# Altium schematic sheet TopDrivers.SchDoc
size A4; SheetNumber: 1; SheetTotal: 2
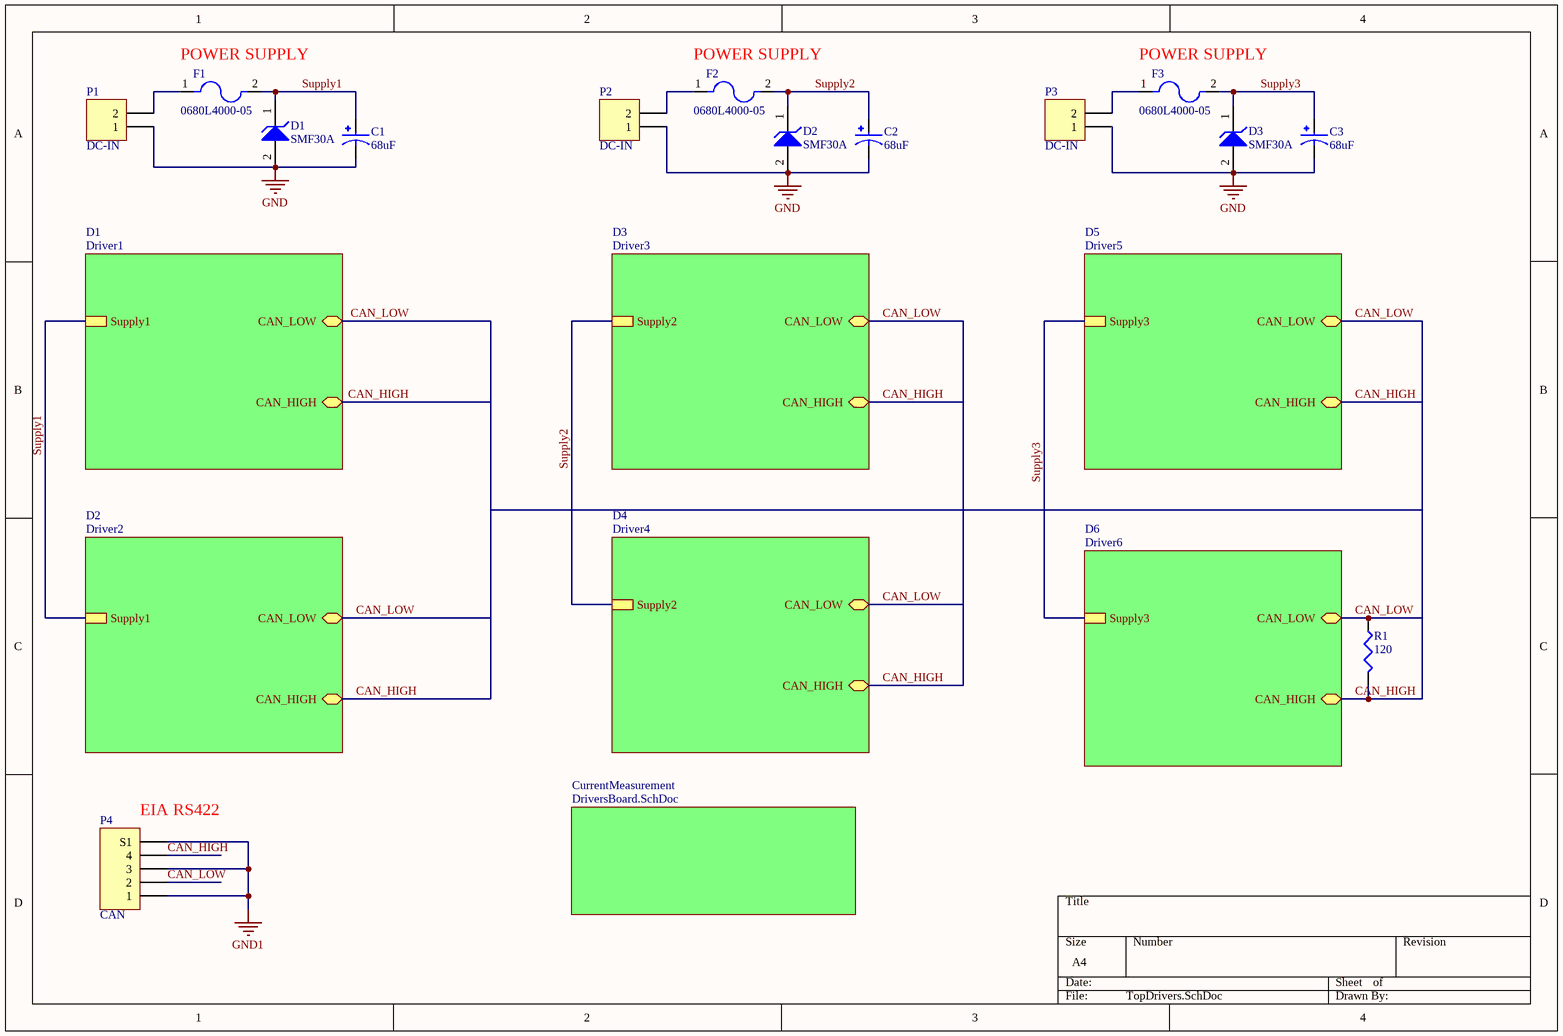
[diagram p0: TopDrivers.SchDoc]

## Parts
C1  68uF  [CAP_50SVT68M]
C2  68uF  [CAP_50SVT68M]
C3  68uF  [CAP_50SVT68M]
D1  SMF30A  [ONSC-SOD-123FL-2-498_V]
D2  SMF30A  [ONSC-SOD-123FL-2-498_V]
D3  SMF30A  [ONSC-SOD-123FL-2-498_V]
F1  0680L4000-05  [FUSC6125X279N]
F2  0680L4000-05  [FUSC6125X279N]
F3  0680L4000-05  [FUSC6125X279N]
P1  DC-IN  [MOLEX_1724480002]
P2  DC-IN  [MOLEX_1724480002]
P3  DC-IN  [MOLEX_1724480002]
P4  CAN  [MOLEX_5025850470]
R1  value 120  [J1-0603]  (hidden comment: Res3)

## Sub-sheets
CurrentMeasurement = DriversBoard.SchDoc: no entries
D1 = Driver1: Supply1, CAN_HIGH (bidir), CAN_LOW (bidir)
D2 = Driver2: CAN_HIGH (bidir), CAN_LOW (bidir), Supply1
D3 = Driver3: CAN_HIGH (bidir), CAN_LOW (bidir), Supply2
D4 = Driver4: CAN_HIGH (bidir), CAN_LOW (bidir), Supply2
D5 = Driver5: CAN_LOW (bidir), CAN_HIGH (bidir), Supply3
D6 = Driver6: CAN_LOW (bidir), CAN_HIGH (bidir), Supply3

## Nets
GND: C1.2 C2.2 C3.2 D1.2(A) D2.2(A) D3.2(A) P1.1 P2.1 P3.1
GND1: P4.1 P4.3 P4.S1
CAN_HIGH: P4.4 R1.2 ; sheet D1/CAN_HIGH, sheet D3/CAN_HIGH, sheet D5/CAN_HIGH, sheet D2/CAN_HIGH, sheet D4/CAN_HIGH, sheet D6/CAN_HIGH
CAN_LOW: P4.2 R1.1 ; sheet D1/CAN_LOW, sheet D3/CAN_LOW, sheet D5/CAN_LOW, sheet D2/CAN_LOW, sheet D4/CAN_LOW, sheet D6/CAN_LOW
Supply1: C1.1 D1.1(K) F1.2 ; sheet D1/Supply1, sheet D2/Supply1
Supply2: C2.1 D2.1(K) F2.2 ; sheet D3/Supply2, sheet D4/Supply2
Supply3: C3.1 D3.1(K) F3.2 ; sheet D5/Supply3, sheet D6/Supply3
NetF1_1: F1.1 P1.2
NetF2_1: F2.1 P2.2
NetF3_1: F3.1 P3.2

## Notes on the sheet
- (near F1) POWER SUPPLY
- (near F2) POWER SUPPLY
- (near F3) POWER SUPPLY
- (near P4) EIA RS422

## Library data of the parts
C1-C3 = 50SVT68M: Package: None; MP: 50SVT68M; Price: None; Availability: Unavailable; Value: *
D1-D3 = SMF30AT1G: 200 W Transient Voltage Suppressor, 2-Pin SOD-123FL, Pb-Free, Tape and Reel; Manufacturer: On Semiconductor; Direction: Unidirectional; IR Max (uA): 1; V(BR) Typ (V): 35.1; DatasheetVersion: Rev. 7; PackageVersion: Rev. D, 05/2013; PackageReference: SOD-123FL-2-498; PackageDescription: 2-Pin SOD, Body 1.65 x 2.7 mm; Supplier 1: Digi-Key; Supplier Part Number 1: SMF30AT1GOSTR-ND; Supplier 2: Digi-Key; Supplier Part Number 2: SMF30AT1GOSCT-ND; Supplier 3: Digi-Key; Supplier Part Number 3: SMF30AT1GOSDKR-ND; Supplier 4: Farnell; Supplier Part Number 4: 2317489; Supplier 5: Newark; Supplier Part Number 5: 09R9720; Supplier 6: Newark; Supplier Part Number 6: 42K2628; Supplier 7: Mouser; Supplier Part Number 7: 863-SMF30AT1G; Packing: Tape and Reel; RoHS: Pb-Free; Mounting Technology: Surface Mount; PartNumber: SMF30AT1G; ComponentLink1Description: Manufacturer URL; ComponentLink1URL: http://www.onsemi.com/; ComponentLink2Description: Datasheet; ComponentLink2URL: http://www.onsemi.com/pub_link/Collateral/SMF5.0AT1-D.PDF; ComponentLink3Description: Package Specification; ComponentLink3URL: http://www.onsemi.com/pub_link/Collateral/498-01.PDF
F1-F3 = 0680L4000-05: Surface mount bricks | Silver Plated | 2410 case size | Slow Blow | 4A | Tape and Reel (5000 pcs.); MF: Bel Fuse; SnapEDA_Link: https://www.snapeda.com/parts/0680L4000-05/Bel+Fuse/view-part/?ref=snap; Purchase-URL: https://pricing.snapeda.com/search/part/0680L4000-05/?ref=eda; Availability: In Stock; MP: 0680L4000-05; Value: *; Price: None; Package: SMD-2 Bel Fuse Inc.; Check_prices: https://www.snapeda.com/parts/0680L4000-05/Bel+Fuse/view-part/?ref=eda
P1-P3 = Header 2: Header, 2-Pin; LatestRevisionDate: 17-Jul-2002; LatestRevisionNote: Re-released for DXP Platform.; Publisher: Altium Limited
P4 = Header 5: Header, 5-Pin; LatestRevisionDate: 17-Jul-2002; LatestRevisionNote: Re-released for DXP Platform.; Publisher: Altium Limited; Part Number: *
R1 = Res3: Resistor; Published: 8-Jun-2000; LatestRevisionDate: 29-May-2009; LatestRevisionNote: IPC-7351 Footprint Added.; PackageReference: J1-0603; Publisher: Altium Limited; PackageDescription: Chip Resistor